# Altium schematic sheet NIXIEclock.SchDoc
size A2
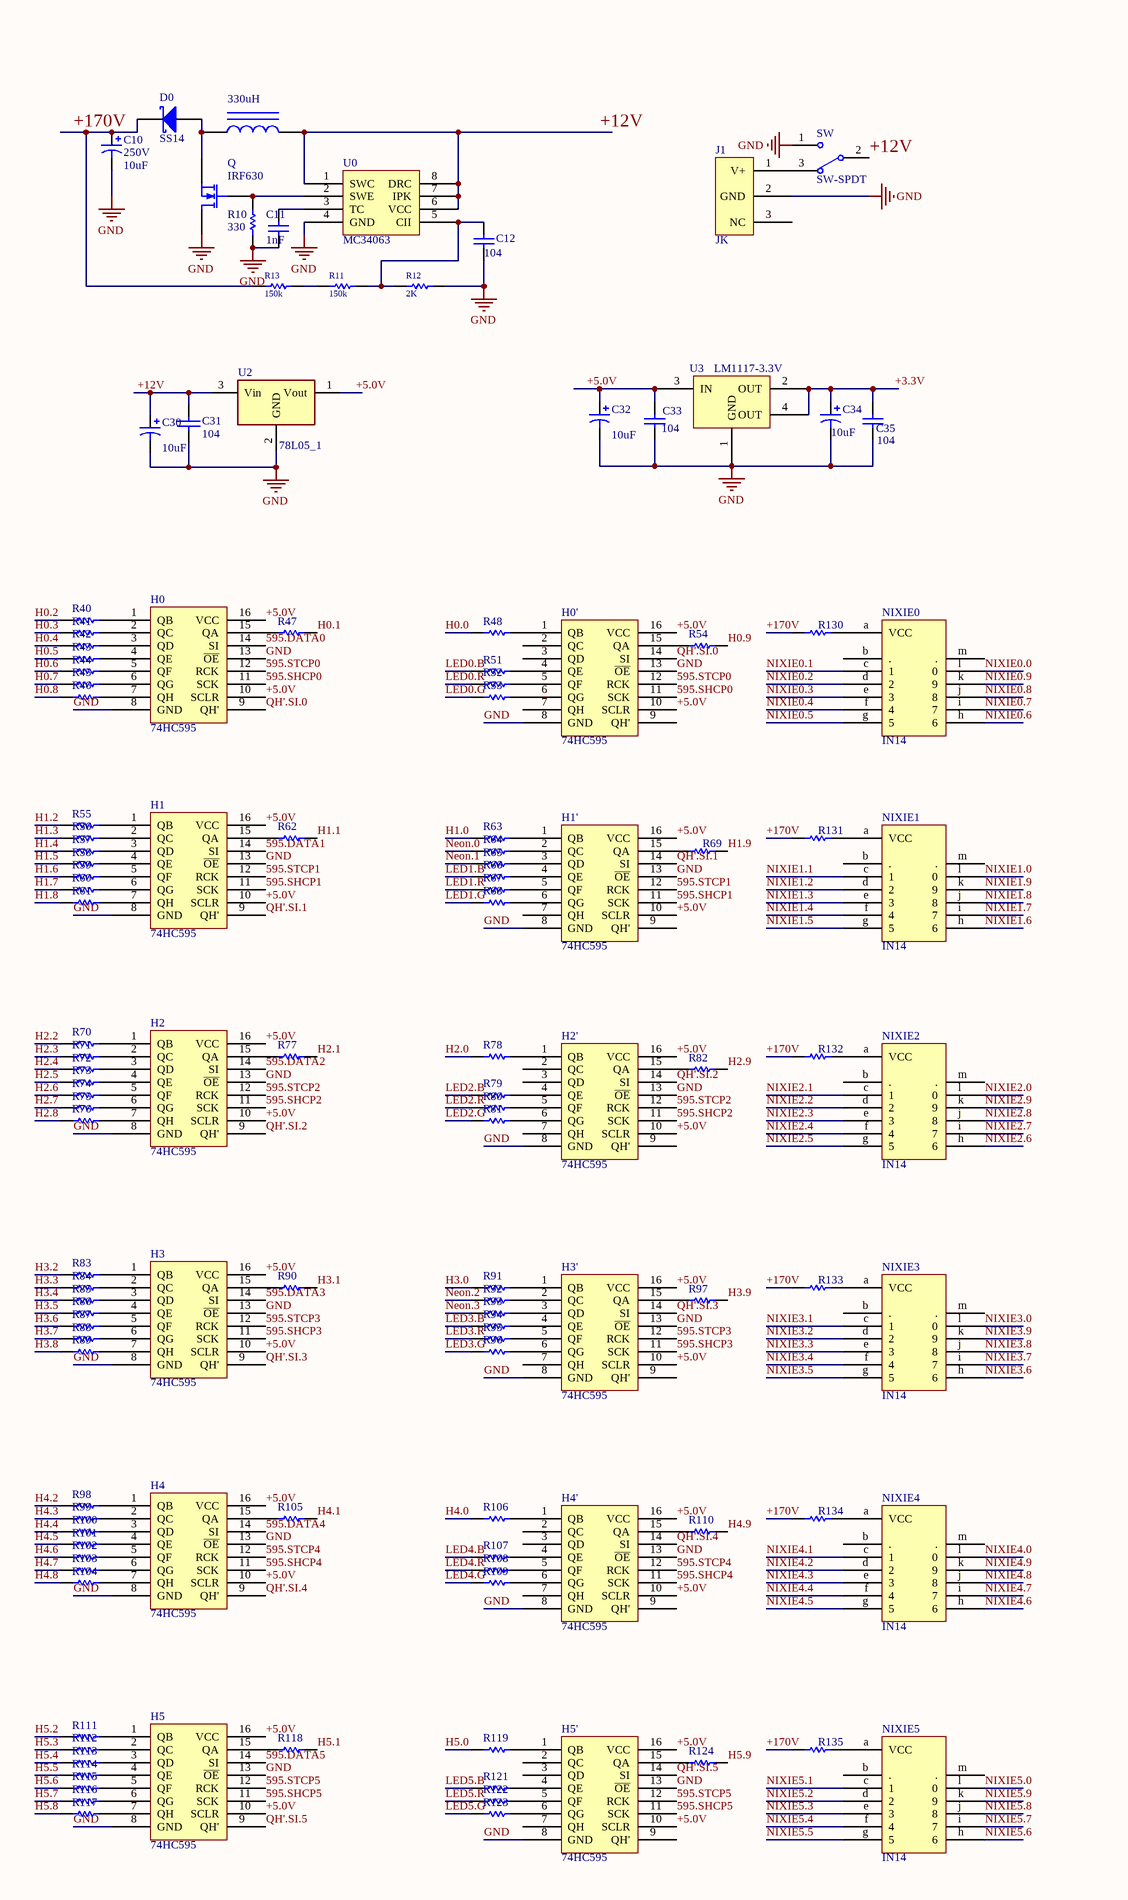
[diagram p0: NIXIEclock.SchDoc, left]
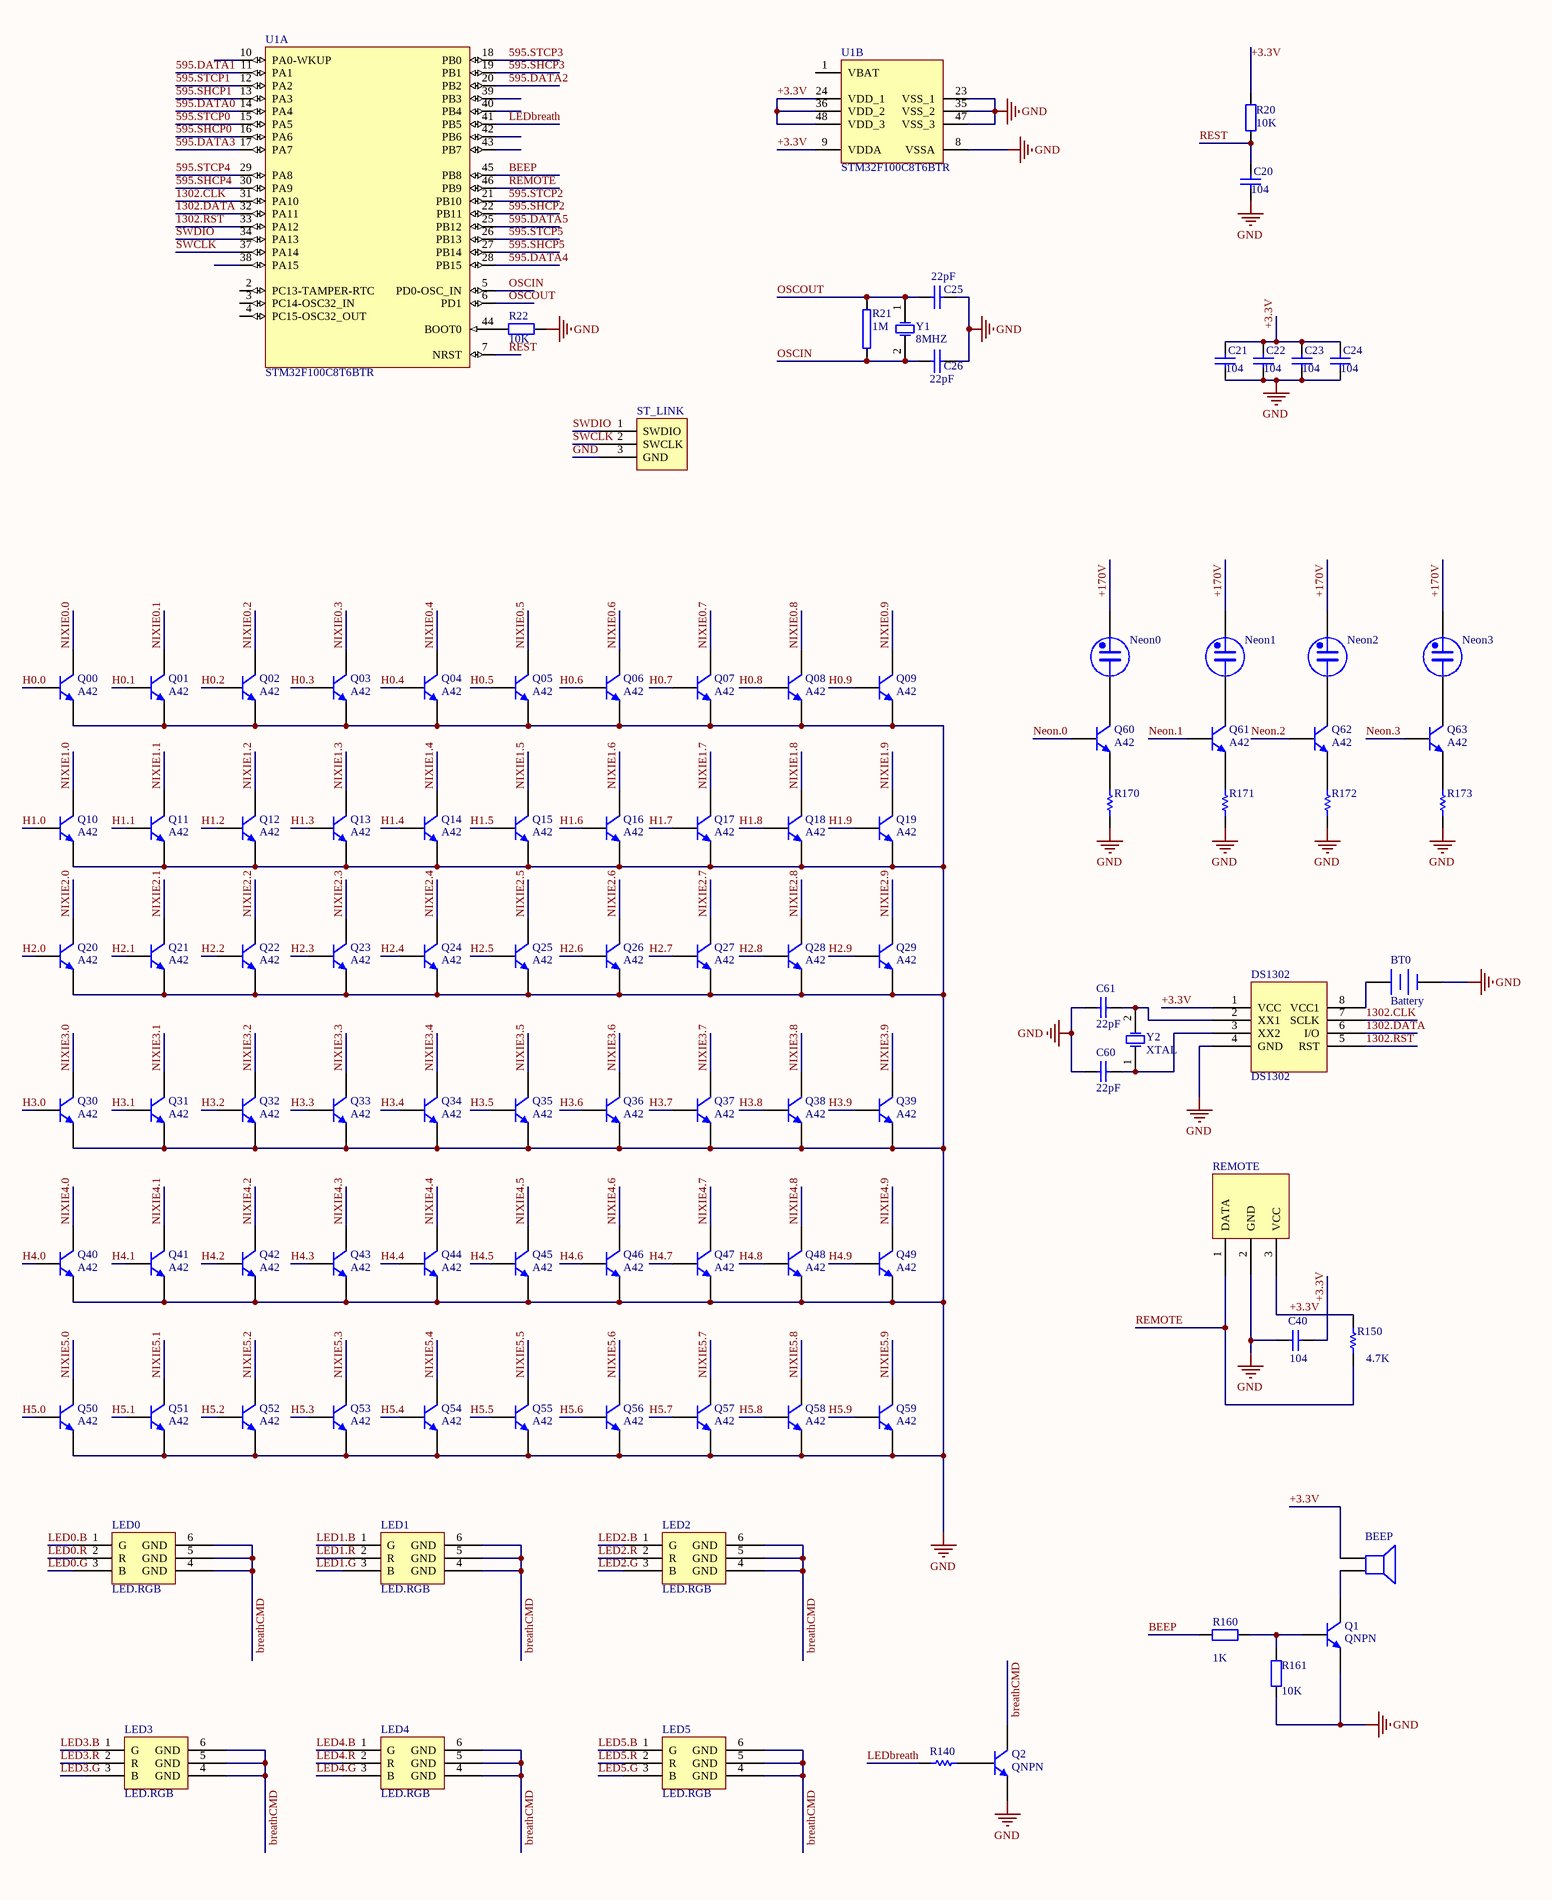
[diagram p1: NIXIEclock.SchDoc, right]

## Parts
BEEP  Speaker  [didi]  (value not drawn)
BT0  Battery  [CR1220]
C10  250V  value 10uF  [1000UF]
C11  value 1nF  [0805_M]  (hidden comment: Cap)
C12  value 104  [0805_M]  (hidden comment: Cap)
C20  value 104  [0805_M]  (hidden comment: Cap Semi)
C21  value 104  [0805_M]  (hidden comment: Cap Semi)
C22  value 104  [0805_M]  (hidden comment: Cap Semi)
C23  value 104  [0805_M]  (hidden comment: Cap Semi)
C24  value 104  [0805_M]  (hidden comment: Cap Semi)
C25  CAP  [0805_M]  (value not drawn)
C26  CAP  [0805_M]  (value not drawn)
C30  value 10uF  [3528]  (hidden comment: Cap Pol1)
C31  104  [0805_M]
C32  value 10uF  [3528]  (hidden comment: Cap Pol1)
C33  value 104  [0805_M]  (hidden comment: Cap Semi)
C34  value 10uF  [3528]  (hidden comment: Cap Pol1)
C35  value 104  [0805_M]  (hidden comment: Cap Semi)
C40  value 104  [0805_M]  (hidden comment: Cap)
C60  value 22pF  [0805_M]  (hidden comment: Cap)
C61  value 22pF  [0805_M]  (hidden comment: Cap)
D0  SS14  [7227]
DS1302  DS1302  [SO-8]
H0  74HC595  [SO-16]
H0'  74HC595  [SO-16]
H1  74HC595  [SO-16]
H1'  74HC595  [SO-16]
H2  74HC595  [SO-16]
H2'  74HC595  [SO-16]
H3  74HC595  [SO-16]
H3'  74HC595  [SO-16]
H4  74HC595  [SO-16]
H4'  74HC595  [SO-16]
H5  74HC595  [SO-16]
H5'  74HC595  [SO-16]
J1  JK  [POWER]
L0  value 330uH  [L101]  (hidden comment: L)
LED0  LED.RGB  [5050LED]
LED1  LED.RGB  [5050LED]
LED2  LED.RGB  [5050LED]
LED3  LED.RGB  [5050LED]
LED4  LED.RGB  [5050LED]
LED5  LED.RGB  [5050LED]
Neon0  Neon  [NEON]  (value not drawn)
Neon1  Neon  [NEON]  (value not drawn)
Neon2  Neon  [NEON]  (value not drawn)
Neon3  Neon  [NEON]  (value not drawn)
NIXIE0  IN14  [IN14]
NIXIE1  IN14  [IN14]
NIXIE2  IN14  [IN14]
NIXIE3  IN14  [IN14]
NIXIE4  IN14  [IN14]
NIXIE5  IN14  [IN14]
Q  IRF630  [TO-220]
Q00  A42  [A42]
Q01  A42  [A42]
Q1  QNPN  [A42]
Q02  A42  [A42]
Q2  QNPN  [A42]
Q03  A42  [A42]
Q04  A42  [A42]
Q05  A42  [A42]
Q06  A42  [A42]
Q07  A42  [A42]
Q08  A42  [A42]
Q09  A42  [A42]
Q10  A42  [A42]
Q11  A42  [A42]
Q12  A42  [A42]
Q13  A42  [A42]
Q14  A42  [A42]
Q15  A42  [A42]
Q16  A42  [A42]
Q17  A42  [A42]
Q18  A42  [A42]
Q19  A42  [A42]
Q20  A42  [A42]
Q21  A42  [A42]
Q22  A42  [A42]
Q23  A42  [A42]
Q24  A42  [A42]
Q25  A42  [A42]
Q26  A42  [A42]
Q27  A42  [A42]
Q28  A42  [A42]
Q29  A42  [A42]
Q30  A42  [A42]
Q31  A42  [A42]
Q32  A42  [A42]
Q33  A42  [A42]
Q34  A42  [A42]
Q35  A42  [A42]
Q36  A42  [A42]
Q37  A42  [A42]
Q38  A42  [A42]
Q39  A42  [A42]
Q40  A42  [A42]
Q41  A42  [A42]
Q42  A42  [A42]
Q43  A42  [A42]
Q44  A42  [A42]
Q45  A42  [A42]
Q46  A42  [A42]
Q47  A42  [A42]
Q48  A42  [A42]
Q49  A42  [A42]
Q50  A42  [A42]
Q51  A42  [A42]
Q52  A42  [A42]
Q53  A42  [A42]
Q54  A42  [A42]
Q55  A42  [A42]
Q56  A42  [A42]
Q57  A42  [A42]
Q58  A42  [A42]
Q59  A42  [A42]
Q60  A42  [A42]
Q61  A42  [A42]
Q62  A42  [A42]
Q63  A42  [A42]
R10  value 330  [0805_M]  (hidden comment: Res1)
R11  value 150k  [0805_M]  (hidden comment: Res1)
R12  2K  [0805_M]
R13  value 150k  [0805_M]  (hidden comment: Res1)
R20  value 10K  [0805_M]  (hidden comment: Res2)
R21  RES  [0805_M]  (value not drawn)
R22  value 10K  [0805_M]  (hidden comment: Res2)
R40  Res1  [0805_M]  (value not drawn)
R41  Res1  [0805_M]  (value not drawn)
R42  Res1  [0805_M]  (value not drawn)
R43  Res1  [0805_M]  (value not drawn)
R44  Res1  [0805_M]  (value not drawn)
R45  Res1  [0805_M]  (value not drawn)
R46  Res1  [0805_M]  (value not drawn)
R47  Res1  [0805_M]  (value not drawn)
R48  Res1  [0805_M]  (value not drawn)
R51  Res1  [0805_M]  (value not drawn)
R52  Res1  [0805_M]  (value not drawn)
R53  Res1  [0805_M]  (value not drawn)
R54  Res1  [0805_M]  (value not drawn)
R55  Res1  [0805_M]  (value not drawn)
R56  Res1  [0805_M]  (value not drawn)
R57  Res1  [0805_M]  (value not drawn)
R58  Res1  [0805_M]  (value not drawn)
R59  Res1  [0805_M]  (value not drawn)
R60  Res1  [0805_M]  (value not drawn)
R61  Res1  [0805_M]  (value not drawn)
R62  Res1  [0805_M]  (value not drawn)
R63  Res1  [0805_M]  (value not drawn)
R64  Res1  [0805_M]  (value not drawn)
R65  Res1  [0805_M]  (value not drawn)
R66  Res1  [0805_M]  (value not drawn)
R67  Res1  [0805_M]  (value not drawn)
R68  Res1  [0805_M]  (value not drawn)
R69  Res1  [0805_M]  (value not drawn)
R70  Res1  [0805_M]  (value not drawn)
R71  Res1  [0805_M]  (value not drawn)
R72  Res1  [0805_M]  (value not drawn)
R73  Res1  [0805_M]  (value not drawn)
R74  Res1  [0805_M]  (value not drawn)
R75  Res1  [0805_M]  (value not drawn)
R76  Res1  [0805_M]  (value not drawn)
R77  Res1  [0805_M]  (value not drawn)
R78  Res1  [0805_M]  (value not drawn)
R79  Res1  [0805_M]  (value not drawn)
R80  Res1  [0805_M]  (value not drawn)
R81  Res1  [0805_M]  (value not drawn)
R82  Res1  [0805_M]  (value not drawn)
R83  Res1  [0805_M]  (value not drawn)
R84  Res1  [0805_M]  (value not drawn)
R85  Res1  [0805_M]  (value not drawn)
R86  Res1  [0805_M]  (value not drawn)
R87  Res1  [0805_M]  (value not drawn)
R88  Res1  [0805_M]  (value not drawn)
R89  Res1  [0805_M]  (value not drawn)
R90  Res1  [0805_M]  (value not drawn)
R91  Res1  [0805_M]  (value not drawn)
R92  Res1  [0805_M]  (value not drawn)
R93  Res1  [0805_M]  (value not drawn)
R94  Res1  [0805_M]  (value not drawn)
R95  Res1  [0805_M]  (value not drawn)
R96  Res1  [0805_M]  (value not drawn)
R97  Res1  [0805_M]  (value not drawn)
R98  Res1  [0805_M]  (value not drawn)
R99  Res1  [0805_M]  (value not drawn)
R100  Res1  [0805_M]  (value not drawn)
R101  Res1  [0805_M]  (value not drawn)
R102  Res1  [0805_M]  (value not drawn)
R103  Res1  [0805_M]  (value not drawn)
R104  Res1  [0805_M]  (value not drawn)
R105  Res1  [0805_M]  (value not drawn)
R106  Res1  [0805_M]  (value not drawn)
R107  Res1  [0805_M]  (value not drawn)
R108  Res1  [0805_M]  (value not drawn)
R109  Res1  [0805_M]  (value not drawn)
R110  Res1  [0805_M]  (value not drawn)
R111  Res1  [0805_M]  (value not drawn)
R112  Res1  [0805_M]  (value not drawn)
R113  Res1  [0805_M]  (value not drawn)
R114  Res1  [0805_M]  (value not drawn)
R115  Res1  [0805_M]  (value not drawn)
R116  Res1  [0805_M]  (value not drawn)
R117  Res1  [0805_M]  (value not drawn)
R118  Res1  [0805_M]  (value not drawn)
R119  Res1  [0805_M]  (value not drawn)
R121  Res1  [0805_M]  (value not drawn)
R122  Res1  [0805_M]  (value not drawn)
R123  Res1  [0805_M]  (value not drawn)
R124  Res1  [0805_M]  (value not drawn)
R130  Res1  [0805_M]  (value not drawn)
R131  Res1  [0805_M]  (value not drawn)
R132  Res1  [0805_M]  (value not drawn)
R133  Res1  [0805_M]  (value not drawn)
R134  Res1  [0805_M]  (value not drawn)
R135  Res1  [0805_M]  (value not drawn)
R140  Res1  [0805_M]  (value not drawn)
R150  value 4.7K  [0805_M]  (hidden comment: Res1)
R160  value 1K  [0805_M]  (hidden comment: Res2)
R161  value 10K  [0805_M]  (hidden comment: Res2)
R170  Res1  [0805_M]  (value not drawn)
R171  Res1  [0805_M]  (value not drawn)
R172  Res1  [0805_M]  (value not drawn)
R173  Res1  [0805_M]  (value not drawn)
REMOTE  REMOTE  [HDR1X3]  (value not drawn)
ST_LINK  ST_LINK  [HDR1X3]  (value not drawn)
SW  SW-SPDT  [SW]
U0  MC34063  [SO-8]
U1  STM32F100C8T6BTR  [LQFP48_M]  (parts A,B of 2)
U2  78L05_1  [78M05 DPAK TO-225]
U3  LM1117-3.3V  [1117]
Y1  8M  [XTAL]  (value not drawn)
Y2  XTAL  [X32768]

## Nets
GND: BT0.2(-) C10.2 C11.2 C12.1 C20.1 C21.1 C22.1 C23.1 C24.1 C25.1 C26.1 C30.2 C31.1 C32.2 C33.1 C34.2 C35.1 C40.1 C60.2 C61.2 DS1302.4(GND) H0.8(GND) H0.13(~{OE}) H0'.8(GND) H0'.13(~{OE}) H1.8(GND) H1.13(~{OE}) H1'.8(GND) H1'.13(~{OE}) H2.8(GND) H2.13(~{OE}) H2'.8(GND) H2'.13(~{OE}) H3.8(GND) H3.13(~{OE}) H3'.8(GND) H3'.13(~{OE}) H4.8(GND) H4.13(~{OE}) H4'.8(GND) H4'.13(~{OE}) H5.8(GND) H5.13(~{OE}) H5'.8(GND) H5'.13(~{OE}) J1.2(GND) Q.1(D) Q00.3(E) Q01.3(E) Q1.3(E) Q02.3(E) Q2.3(E) Q03.3(E) Q04.3(E) Q05.3(E) Q06.3(E) Q07.3(E) Q08.3(E) Q09.3(E) Q10.3(E) Q11.3(E) Q12.3(E) Q13.3(E) Q14.3(E) Q15.3(E) Q16.3(E) Q17.3(E) Q18.3(E) Q19.3(E) Q20.3(E) Q21.3(E) Q22.3(E) Q23.3(E) Q24.3(E) Q25.3(E) Q26.3(E) Q27.3(E) Q28.3(E) Q29.3(E) Q30.3(E) Q31.3(E) Q32.3(E) Q33.3(E) Q34.3(E) Q35.3(E) Q36.3(E) Q37.3(E) Q38.3(E) Q39.3(E) Q40.3(E) Q41.3(E) Q42.3(E) Q43.3(E) Q44.3(E) Q45.3(E) Q46.3(E) Q47.3(E) Q48.3(E) Q49.3(E) Q50.3(E) Q51.3(E) Q52.3(E) Q53.3(E) Q54.3(E) Q55.3(E) Q56.3(E) Q57.3(E) Q58.3(E) Q59.3(E) R10.1 R12.1 R22.2 R161.1 R170.2 R171.2 R172.2 R173.2 REMOTE.2(GND) ST_LINK.3(GND) SW.1 U0.4(GND) U1.8(VSSA) U1.23(VSS_1) U1.35(VSS_2) U1.47(VSS_3) U2.2(GND) U3.1(GND)
595.DATA0: H0.14(SI) U1.14(PA4)
595.DATA1: H1.14(SI) U1.11(PA1)
595.DATA2: H2.14(SI) U1.20(PB2)
595.DATA3: H3.14(SI) U1.17(PA7)
595.DATA4: H4.14(SI) U1.28(PB15)
595.DATA5: H5.14(SI) U1.25(PB12)
595.SHCP0: H0.11(SCK) H0'.11(SCK) U1.16(PA6)
595.SHCP1: H1.11(SCK) H1'.11(SCK) U1.13(PA3)
595.SHCP2: H2.11(SCK) H2'.11(SCK) U1.22(PB11)
595.SHCP3: H3.11(SCK) H3'.11(SCK) U1.19(PB1)
595.SHCP4: H4.11(SCK) H4'.11(SCK) U1.30(PA9)
595.SHCP5: H5.11(SCK) H5'.11(SCK) U1.27(PB14)
595.STCP0: H0.12(RCK) H0'.12(RCK) U1.15(PA5)
595.STCP1: H1.12(RCK) H1'.12(RCK) U1.12(PA2)
595.STCP2: H2.12(RCK) H2'.12(RCK) U1.21(PB10)
595.STCP3: H3.12(RCK) H3'.12(RCK) U1.18(PB0)
595.STCP4: H4.12(RCK) H4'.12(RCK) U1.29(PA8)
595.STCP5: H5.12(RCK) H5'.12(RCK) U1.26(PB13)
1302.CLK: DS1302.7(SCLK) U1.31(PA10)
1302.DATA: DS1302.6(I/O) U1.32(PA11)
1302.RST: DS1302.5(RST) U1.33(PA12)
+3.3V: BEEP.1 C21.2 C22.2 C23.2 C24.2 C34.1 C35.2 C40.2 DS1302.1(VCC) R20.1 R150.1 REMOTE.3(VCC) U1.9(VDDA) U1.24(VDD_1) U1.36(VDD_2) U1.48(VDD_3) U3.2(OUT) U3.4(OUT)
+5.0V: C32.1 C33.2 H0.10(SCLR) H0.16(VCC) H0'.10(SCLR) H0'.16(VCC) H1.10(SCLR) H1.16(VCC) H1'.10(SCLR) H1'.16(VCC) H2.10(SCLR) H2.16(VCC) H2'.10(SCLR) H2'.16(VCC) H3.10(SCLR) H3.16(VCC) H3'.10(SCLR) H3'.16(VCC) H4.10(SCLR) H4.16(VCC) H4'.10(SCLR) H4'.16(VCC) H5.10(SCLR) H5.16(VCC) H5'.10(SCLR) H5'.16(VCC) U2.1(Vout) U3.3(IN)
+12V: C30.1 C31.2 L0.2 SW.2 U0.1(SWC) U0.6(VCC) U0.7(IPK) U0.8(DRC) U2.3(Vin)
+170V: C10.1 D0.1(K) Neon0.1 Neon1.1 Neon2.1 Neon3.1 R13.2 R130.2 R131.2 R132.2 R133.2 R134.2 R135.2
BEEP: R160.1 U1.45(PB8)
breathCMD: LED0.4(GND) LED0.5(GND) LED0.6(GND) LED1.4(GND) LED1.5(GND) LED1.6(GND) LED2.4(GND) LED2.5(GND) LED2.6(GND) LED3.4(GND) LED3.5(GND) LED3.6(GND) LED4.4(GND) LED4.5(GND) LED4.6(GND) LED5.4(GND) LED5.5(GND) LED5.6(GND) Q2.1(C)
H0.0: Q00.2(B) R48.2
H0.1: Q01.2(B) R47.1
H0.2: Q02.2(B) R40.2
H0.3: Q03.2(B) R41.2
H0.4: Q04.2(B) R42.2
H0.5: Q05.2(B) R43.2
H0.6: Q06.2(B) R44.2
H0.7: Q07.2(B) R45.2
H0.8: Q08.2(B) R46.2
H0.9: Q09.2(B) R54.1
H1.0: Q10.2(B) R63.2
H1.1: Q11.2(B) R62.1
H1.2: Q12.2(B) R55.2
H1.3: Q13.2(B) R56.2
H1.4: Q14.2(B) R57.2
H1.5: Q15.2(B) R58.2
H1.6: Q16.2(B) R59.2
H1.7: Q17.2(B) R60.2
H1.8: Q18.2(B) R61.2
H1.9: Q19.2(B) R69.1
H2.0: Q20.2(B) R78.2
H2.1: Q21.2(B) R77.1
H2.2: Q22.2(B) R70.2
H2.3: Q23.2(B) R71.2
H2.4: Q24.2(B) R72.2
H2.5: Q25.2(B) R73.2
H2.6: Q26.2(B) R74.2
H2.7: Q27.2(B) R75.2
H2.8: Q28.2(B) R76.2
H2.9: Q29.2(B) R82.1
H3.0: Q30.2(B) R91.2
H3.1: Q31.2(B) R90.1
H3.2: Q32.2(B) R83.2
H3.3: Q33.2(B) R84.2
H3.4: Q34.2(B) R85.2
H3.5: Q35.2(B) R86.2
H3.6: Q36.2(B) R87.2
H3.7: Q37.2(B) R88.2
H3.8: Q38.2(B) R89.2
H3.9: Q39.2(B) R97.1
H4.0: Q40.2(B) R106.2
H4.1: Q41.2(B) R105.1
H4.2: Q42.2(B) R98.2
H4.3: Q43.2(B) R99.2
H4.4: Q44.2(B) R100.2
H4.5: Q45.2(B) R101.2
H4.6: Q46.2(B) R102.2
H4.7: Q47.2(B) R103.2
H4.8: Q48.2(B) R104.2
H4.9: Q49.2(B) R110.1
H5.0: Q50.2(B) R119.2
H5.1: Q51.2(B) R118.1
H5.2: Q52.2(B) R111.2
H5.3: Q53.2(B) R112.2
H5.4: Q54.2(B) R113.2
H5.5: Q55.2(B) R114.2
H5.6: Q56.2(B) R115.2
H5.7: Q57.2(B) R116.2
H5.8: Q58.2(B) R117.2
H5.9: Q59.2(B) R124.1
LED0.B: LED0.1(G) R51.2
LED0.G: LED0.3(B) R53.2
LED0.R: LED0.2(R) R52.2
LED1.B: LED1.1(G) R66.2
LED1.G: LED1.3(B) R68.2
LED1.R: LED1.2(R) R67.2
LED2.B: LED2.1(G) R79.2
LED2.G: LED2.3(B) R81.2
LED2.R: LED2.2(R) R80.2
LED3.B: LED3.1(G) R94.2
LED3.G: LED3.3(B) R96.2
LED3.R: LED3.2(R) R95.2
LED4.B: LED4.1(G) R107.2
LED4.G: LED4.3(B) R109.2
LED4.R: LED4.2(R) R108.2
LED5.B: LED5.1(G) R121.2
LED5.G: LED5.3(B) R123.2
LED5.R: LED5.2(R) R122.2
LEDbreath: R140.2 U1.41(PB5)
Neon.0: Q60.2(B) R64.2
Neon.1: Q61.2(B) R65.2
Neon.2: Q62.2(B) R92.2
Neon.3: Q63.2(B) R93.2
NIXIE0.0: NIXIE0.l(0) Q00.1(C)
NIXIE0.1: NIXIE0.c(1) Q01.1(C)
NIXIE0.2: NIXIE0.d(2) Q02.1(C)
NIXIE0.3: NIXIE0.e(3) Q03.1(C)
NIXIE0.4: NIXIE0.f(4) Q04.1(C)
NIXIE0.5: NIXIE0.g(5) Q05.1(C)
NIXIE0.6: NIXIE0.h(6) Q06.1(C)
NIXIE0.7: NIXIE0.i(7) Q07.1(C)
NIXIE0.8: NIXIE0.j(8) Q08.1(C)
NIXIE0.9: NIXIE0.k(9) Q09.1(C)
NIXIE1.0: NIXIE1.l(0) Q10.1(C)
NIXIE1.1: NIXIE1.c(1) Q11.1(C)
NIXIE1.2: NIXIE1.d(2) Q12.1(C)
NIXIE1.3: NIXIE1.e(3) Q13.1(C)
NIXIE1.4: NIXIE1.f(4) Q14.1(C)
NIXIE1.5: NIXIE1.g(5) Q15.1(C)
NIXIE1.6: NIXIE1.h(6) Q16.1(C)
NIXIE1.7: NIXIE1.i(7) Q17.1(C)
NIXIE1.8: NIXIE1.j(8) Q18.1(C)
NIXIE1.9: NIXIE1.k(9) Q19.1(C)
NIXIE2.0: NIXIE2.l(0) Q20.1(C)
NIXIE2.1: NIXIE2.c(1) Q21.1(C)
NIXIE2.2: NIXIE2.d(2) Q22.1(C)
NIXIE2.3: NIXIE2.e(3) Q23.1(C)
NIXIE2.4: NIXIE2.f(4) Q24.1(C)
NIXIE2.5: NIXIE2.g(5) Q25.1(C)
NIXIE2.6: NIXIE2.h(6) Q26.1(C)
NIXIE2.7: NIXIE2.i(7) Q27.1(C)
NIXIE2.8: NIXIE2.j(8) Q28.1(C)
NIXIE2.9: NIXIE2.k(9) Q29.1(C)
NIXIE3.0: NIXIE3.l(0) Q30.1(C)
NIXIE3.1: NIXIE3.c(1) Q31.1(C)
NIXIE3.2: NIXIE3.d(2) Q32.1(C)
NIXIE3.3: NIXIE3.e(3) Q33.1(C)
NIXIE3.4: NIXIE3.f(4) Q34.1(C)
NIXIE3.5: NIXIE3.g(5) Q35.1(C)
NIXIE3.6: NIXIE3.h(6) Q36.1(C)
NIXIE3.7: NIXIE3.i(7) Q37.1(C)
NIXIE3.8: NIXIE3.j(8) Q38.1(C)
NIXIE3.9: NIXIE3.k(9) Q39.1(C)
NIXIE4.0: NIXIE4.l(0) Q40.1(C)
NIXIE4.1: NIXIE4.c(1) Q41.1(C)
NIXIE4.2: NIXIE4.d(2) Q42.1(C)
NIXIE4.3: NIXIE4.e(3) Q43.1(C)
NIXIE4.4: NIXIE4.f(4) Q44.1(C)
NIXIE4.5: NIXIE4.g(5) Q45.1(C)
NIXIE4.6: NIXIE4.h(6) Q46.1(C)
NIXIE4.7: NIXIE4.i(7) Q47.1(C)
NIXIE4.8: NIXIE4.j(8) Q48.1(C)
NIXIE4.9: NIXIE4.k(9) Q49.1(C)
NIXIE5.0: NIXIE5.l(0) Q50.1(C)
NIXIE5.1: NIXIE5.c(1) Q51.1(C)
NIXIE5.2: NIXIE5.d(2) Q52.1(C)
NIXIE5.3: NIXIE5.e(3) Q53.1(C)
NIXIE5.4: NIXIE5.f(4) Q54.1(C)
NIXIE5.5: NIXIE5.g(5) Q55.1(C)
NIXIE5.6: NIXIE5.h(6) Q56.1(C)
NIXIE5.7: NIXIE5.i(7) Q57.1(C)
NIXIE5.8: NIXIE5.j(8) Q58.1(C)
NIXIE5.9: NIXIE5.k(9) Q59.1(C)
OSCIN: C26.2 R21.1 U1.5(PD0-OSC_IN) Y1.2(OSC2)
OSCOUT: C25.2 R21.2 U1.6(PD1) Y1.1(OSC1)
QH'.SI.0: H0.9(QH') H0'.14(SI)
QH'.SI.1: H1.9(QH') H1'.14(SI)
QH'.SI.2: H2.9(QH') H2'.14(SI)
QH'.SI.3: H3.9(QH') H3'.14(SI)
QH'.SI.4: H4.9(QH') H4'.14(SI)
QH'.SI.5: H5.9(QH') H5'.14(SI)
REMOTE: R150.2 REMOTE.1(DATA) U1.46(PB9)
REST: C20.2 R20.2 U1.7(NRST)
SWCLK: ST_LINK.2(SWCLK) U1.37(PA14)
SWDIO: ST_LINK.1(SWDIO) U1.34(PA13)
NetBEEP_2: BEEP.2 Q1.1(C)
NetBT0_1: BT0.1(+) DS1302.8(VCC1)
NetC11_1: C11.1 U0.3(TC)
NetC12_2: C12.2 R11.1 R12.2 U0.5(CII)
NetC60_1: C60.1 DS1302.3(XX2) Y2.1(OSC1)
NetC61_1: C61.1 DS1302.2(XX1) Y2.2(OSC2)
NetD0_3: D0.3(A) L0.1 Q.3(S)
NetH0'_1: H0'.1(QB) R48.1
NetH0'_4: H0'.4(QE) R51.1
NetH0'_5: H0'.5(QF) R52.1
NetH0'_6: H0'.6(QG) R53.1
NetH0'_15: H0'.15(QA) R54.2
NetH0_1: H0.1(QB) R40.1
NetH0_2: H0.2(QC) R41.1
NetH0_3: H0.3(QD) R42.1
NetH0_4: H0.4(QE) R43.1
NetH0_5: H0.5(QF) R44.1
NetH0_6: H0.6(QG) R45.1
NetH0_7: H0.7(QH) R46.1
NetH0_15: H0.15(QA) R47.2
NetH1'_1: H1'.1(QB) R63.1
NetH1'_2: H1'.2(QC) R64.1
NetH1'_3: H1'.3(QD) R65.1
NetH1'_4: H1'.4(QE) R66.1
NetH1'_5: H1'.5(QF) R67.1
NetH1'_6: H1'.6(QG) R68.1
NetH1'_15: H1'.15(QA) R69.2
NetH1_1: H1.1(QB) R55.1
NetH1_2: H1.2(QC) R56.1
NetH1_3: H1.3(QD) R57.1
NetH1_4: H1.4(QE) R58.1
NetH1_5: H1.5(QF) R59.1
NetH1_6: H1.6(QG) R60.1
NetH1_7: H1.7(QH) R61.1
NetH1_15: H1.15(QA) R62.2
NetH2'_1: H2'.1(QB) R78.1
NetH2'_4: H2'.4(QE) R79.1
NetH2'_5: H2'.5(QF) R80.1
NetH2'_6: H2'.6(QG) R81.1
NetH2'_15: H2'.15(QA) R82.2
NetH2_1: H2.1(QB) R70.1
NetH2_2: H2.2(QC) R71.1
NetH2_3: H2.3(QD) R72.1
NetH2_4: H2.4(QE) R73.1
NetH2_5: H2.5(QF) R74.1
NetH2_6: H2.6(QG) R75.1
NetH2_7: H2.7(QH) R76.1
NetH2_15: H2.15(QA) R77.2
NetH3'_1: H3'.1(QB) R91.1
NetH3'_2: H3'.2(QC) R92.1
NetH3'_3: H3'.3(QD) R93.1
NetH3'_4: H3'.4(QE) R94.1
NetH3'_5: H3'.5(QF) R95.1
NetH3'_6: H3'.6(QG) R96.1
NetH3'_15: H3'.15(QA) R97.2
NetH3_1: H3.1(QB) R83.1
NetH3_2: H3.2(QC) R84.1
NetH3_3: H3.3(QD) R85.1
NetH3_4: H3.4(QE) R86.1
NetH3_5: H3.5(QF) R87.1
NetH3_6: H3.6(QG) R88.1
NetH3_7: H3.7(QH) R89.1
NetH3_15: H3.15(QA) R90.2
NetH4'_1: H4'.1(QB) R106.1
NetH4'_4: H4'.4(QE) R107.1
NetH4'_5: H4'.5(QF) R108.1
NetH4'_6: H4'.6(QG) R109.1
NetH4'_15: H4'.15(QA) R110.2
NetH4_1: H4.1(QB) R98.1
NetH4_2: H4.2(QC) R99.1
NetH4_3: H4.3(QD) R100.1
NetH4_4: H4.4(QE) R101.1
NetH4_5: H4.5(QF) R102.1
NetH4_6: H4.6(QG) R103.1
NetH4_7: H4.7(QH) R104.1
NetH4_15: H4.15(QA) R105.2
NetH5'_1: H5'.1(QB) R119.1
NetH5'_4: H5'.4(QE) R121.1
NetH5'_5: H5'.5(QF) R122.1
NetH5'_6: H5'.6(QG) R123.1
NetH5'_15: H5'.15(QA) R124.2
NetH5_1: H5.1(QB) R111.1
NetH5_2: H5.2(QC) R112.1
NetH5_3: H5.3(QD) R113.1
NetH5_4: H5.4(QE) R114.1
NetH5_5: H5.5(QF) R115.1
NetH5_6: H5.6(QG) R116.1
NetH5_7: H5.7(QH) R117.1
NetH5_15: H5.15(QA) R118.2
NetJ1_1: J1.1(V+) SW.3
NetNeon0_2: Neon0.2 Q60.1(C)
NetNeon1_2: Neon1.2 Q61.1(C)
NetNeon2_2: Neon2.2 Q62.1(C)
NetNeon3_2: Neon3.2 Q63.1(C)
NetNIXIE0_a: NIXIE0.a(VCC) R130.1
NetNIXIE1_a: NIXIE1.a(VCC) R131.1
NetNIXIE2_a: NIXIE2.a(VCC) R132.1
NetNIXIE3_a: NIXIE3.a(VCC) R133.1
NetNIXIE4_a: NIXIE4.a(VCC) R134.1
NetNIXIE5_a: NIXIE5.a(VCC) R135.1
NetQ1_2: Q1.2(B) R160.2 R161.2
NetQ2_2: Q2.2(B) R140.1
NetQ60_3: Q60.3(E) R170.1
NetQ61_3: Q61.3(E) R171.1
NetQ62_3: Q62.3(E) R172.1
NetQ63_3: Q63.3(E) R173.1
NetQ_2: Q.2(G) R10.2 U0.2(SWE)
NetR11_2: R11.2 R13.1
NetR22_1: R22.1 U1.44(BOOT0)

Not connected (* = marked no-connect by the designer): H0' 2(QC) 3(QD) 7(QH) 9(QH'); H1' 7(QH) 9(QH'); H2' 2(QC) 3(QD) 7(QH) 9(QH'); H3' 7(QH) 9(QH'); H4' 2(QC) 3(QD) 7(QH) 9(QH'); H5' 2(QC) 3(QD) 7(QH) 9(QH'); J1 3(NC); NIXIE0 b(.) m(.); NIXIE1 b(.) m(.); NIXIE2 b(.) m(.); NIXIE3 b(.) m(.); NIXIE4 b(.) m(.); NIXIE5 b(.) m(.); U1 1(VBAT) 2(PC13-TAMPER-RTC) 3(PC14-OSC32_IN) 4(PC15-OSC32_OUT) 10(PA0-WKUP) 38(PA15) 39(PB3) 40(PB4) 42(PB6) 43(PB7)

## Notes on the sheet
- (in symbol CAP) 22pF
- (in symbol RES) 1M
- (in symbol XTAL) 8MHZ

## Library data of the parts
BEEP = Speaker: Loudspeaker; Published: 24-Mar-1999; LatestRevisionDate: 17-Jul-2002; LatestRevisionNote: Re-released for DXP Platform.; PackageReference: PIN2; Publisher: Altium Limited
BT0 = Battery: Multicell Battery; Published: 24-Mar-1999; LatestRevisionDate: 17-Jul-2002; LatestRevisionNote: Re-released for DXP Platform.; PackageReference: BAT-2; Publisher: Altium Limited; PackageDescription: Battery; 2 Leads
C10 C30 C32 C34 = Cap Pol1: Polarized Capacitor (Radial); Published: 8-Jun-2000; LatestRevisionDate: 17-Jul-2002; LatestRevisionNote: Re-released for DXP Platform.; PackageReference: RB7.6-15; Publisher: Altium Limited; PackageDescription: Polarized Capacitor (Radial); 2 Leads
C11 C12 C40 C60 C61 = Cap: Capacitor; Published: 8-Jun-2000; LatestRevisionDate: 17-Jul-2002; LatestRevisionNote: Re-released for DXP Platform.; PackageReference: RAD-0.3; Publisher: Altium Limited; PackageDescription: Radial Cap, Thru-Hole; 2 Leads; 0.3 in Pin Spacing
C20-C24 C33 C35 = Cap Semi: Capacitor (Semiconductor SIM Model); Published: 8-Jun-2000; LatestRevisionDate: 29-May-2009; LatestRevisionNote: IPC-7351 Footprint Added.; PackageReference: C1206; Publisher: Altium Limited; PackageDescription: Chip Capacitor
C31 = CAP: Capacitor
D0 = Diode 18TQ045: Schottky Rectifier; pin to pad: 1>2 3>1; Note: Terminal 2 is the TAB and is electrically connected to the cathode; Published: 8-Jun-2000; LatestRevisionDate: 17-Jul-2002; LatestRevisionNote: Re-released for DXP Platform.; DatasheetVersion: Dec-1997; PackageVersion: Feb-1998; PackageReference: TO-220AC; Publisher: Altium Limited; PackageDescription: TO, Thru-Hole, Vertical, Heatsink Mounted; 3 In-Line Leads (1 Absent); Pitch 2.54 mm; ComponentLink1Description: Manufacturer Link; ComponentLink1URL: http://www.irf.com/; ComponentLink2Description: Datasheet; ComponentLink2URL: http://www.irf.com/product-info/datasheets/data/18tq.pdf
DS1302 = Component_3
L0 = Inductor Iron: Magnetic-Core Inductor; Published: 24-Mar-1999; LatestRevisionDate: 17-Jul-2002; LatestRevisionNote: Re-released for DXP Platform.; PackageReference: AXIAL-0.9; Publisher: Altium Limited; PackageDescription: Axial Device, Thru-Hole; 2 Leads; 0.9 in Pin Spacing
Neon0-Neon3 = Neon: Neon Bulb; Published: 24-Mar-1999; LatestRevisionDate: 17-Jul-2002; LatestRevisionNote: Re-released for DXP Platform.; PackageReference: PIN2; Publisher: Altium Limited
Q = MOSFET-N: N-Channel MOSFET; pin to pad: 2>3 3>2; Published: 8-Jun-2000; LatestRevisionDate: 17-Jul-2002; LatestRevisionNote: Re-released for DXP Platform.; PackageVersion: 1995/1996; PackageReference: E3; Publisher: Altium Limited; PackageDescription: TO, Flat Index; 3 In-Line, Axial Leads; Body Dia. 4.6mm; Lead Dia. 0.5 mm (max)
Q00 Q01 Q1 Q02 Q2 Q03 Q04 Q05 Q06 Q07 Q08 Q09-Q63 = QNPN: NPN Bipolar Transistor; Published: 8-Jun-2000; LatestRevisionDate: 29-May-2009; LatestRevisionNote: IPC-7351 Footprint Added.; PackageVersion: Aug-1999; PackageReference: SOT-23B; Publisher: Altium Limited; PackageDescription: 3-Pin SOT-23 Package 0.95 mm Pitch, 2.4 mm Lead Span
R10-R13 R150 = Res1: Resistor; Published: 8-Jun-2000; LatestRevisionDate: 17-Jul-2002; LatestRevisionNote: Re-released for DXP Platform.; PackageReference: AXIAL-0.3; Publisher: Altium Limited; PackageDescription: Axial Device, Thru-Hole; 2 Leads; 0.3 in Pin Spacing
R20 R22 R160 R161 = Res2: Resistor; Published: 8-Jun-2000; LatestRevisionDate: 17-Jul-2002; LatestRevisionNote: Re-released for DXP Platform.; PackageReference: AXIAL-0.4; Publisher: Altium Limited
  R160 R161: PackageDescription: Axial Device, Thru-Hole; 2 Leads; 0.4 in Pin Spacing
R40-R48 R51-R119 R121-R124 R130-R135 R140 R170-R173 = Res1: Resistor; Value: 10K; Published: 8-Jun-2000; LatestRevisionDate: 17-Jul-2002; LatestRevisionNote: Re-released for DXP Platform.; PackageReference: AXIAL-0.3; Publisher: Altium Limited; PackageDescription: Axial Device, Thru-Hole; 2 Leads; 0.3 in Pin Spacing
SW = SW-SPDT: SPDT Subminiature Toggle Switch, Right Angle Mounting, Vertical Actuation; Published: 24-Mar-1999; LatestRevisionDate: 17-Dec-2003; LatestRevisionNote: Schematic revised, PCB Footprint replaced.; DatasheetVersion: 05-Dec-2000; PackageReference: TL36WW15050; Publisher: Altium Limited; PackageDescription: Switch; 4 Leads; ComponentLink1Description: Manufacturer Link; ComponentLink1URL: http://www.apem.com
U1 = STM32F100C8T6BTR: STM32 ARM-based 32-bit MCU Value Line with 64 kB Flash, 8 kB Internal RAM, Internal Code B, -40 to +85°C Temperature, 48-Pin LQFP, Tape and Reel; DatasheetVersion: rev6.0, Apr-2011; PackageVersion: rev13, Apr-2011; PackageReference: LQFP48; PackageDescription: 48-Pin Low-Profile Quad Flat Pack, 7 x 7 mm Body, 0.5 mm Pitch (LQFP48); ComponentLink1Description: Manufacturer URL; ComponentLink1URL: http://www.st.com/; ComponentLink2Description: STM32F100 Datasheet; ComponentLink2URL: http://www.st.com/internet/com/TECHNICAL_RESOURCES/TECHNICAL_LITERATURE/DATASHEET/CD00251732.pdf; ComponentLink3Description: STM32 Family Web Page; ComponentLink3URL: www.st.com/stm32
U3 = 1117-5.0
Y1 = XTAL: Crystal Oscillator; Published: 8-Jun-2000; LatestRevisionDate: 17-Jul-2002; LatestRevisionNote: Re-released for DXP Platform.; PackageReference: R38; Publisher: Altium Limited
Y2 = XTAL: Crystal Oscillator; pin to pad: 1>2 2>1; Published: 8-Jun-2000; LatestRevisionDate: 17-Jul-2002; LatestRevisionNote: Re-released for DXP Platform.; PackageReference: R38; Publisher: Altium Limited; PackageDescription: Crystal, Thru-Hole; 2 Leads; Body 3.1 x 8.2 mm (Dia.xH)